# Altium schematic sheet Matrix.SchDoc
size B; SheetNumber: 2; SheetTotal: 2
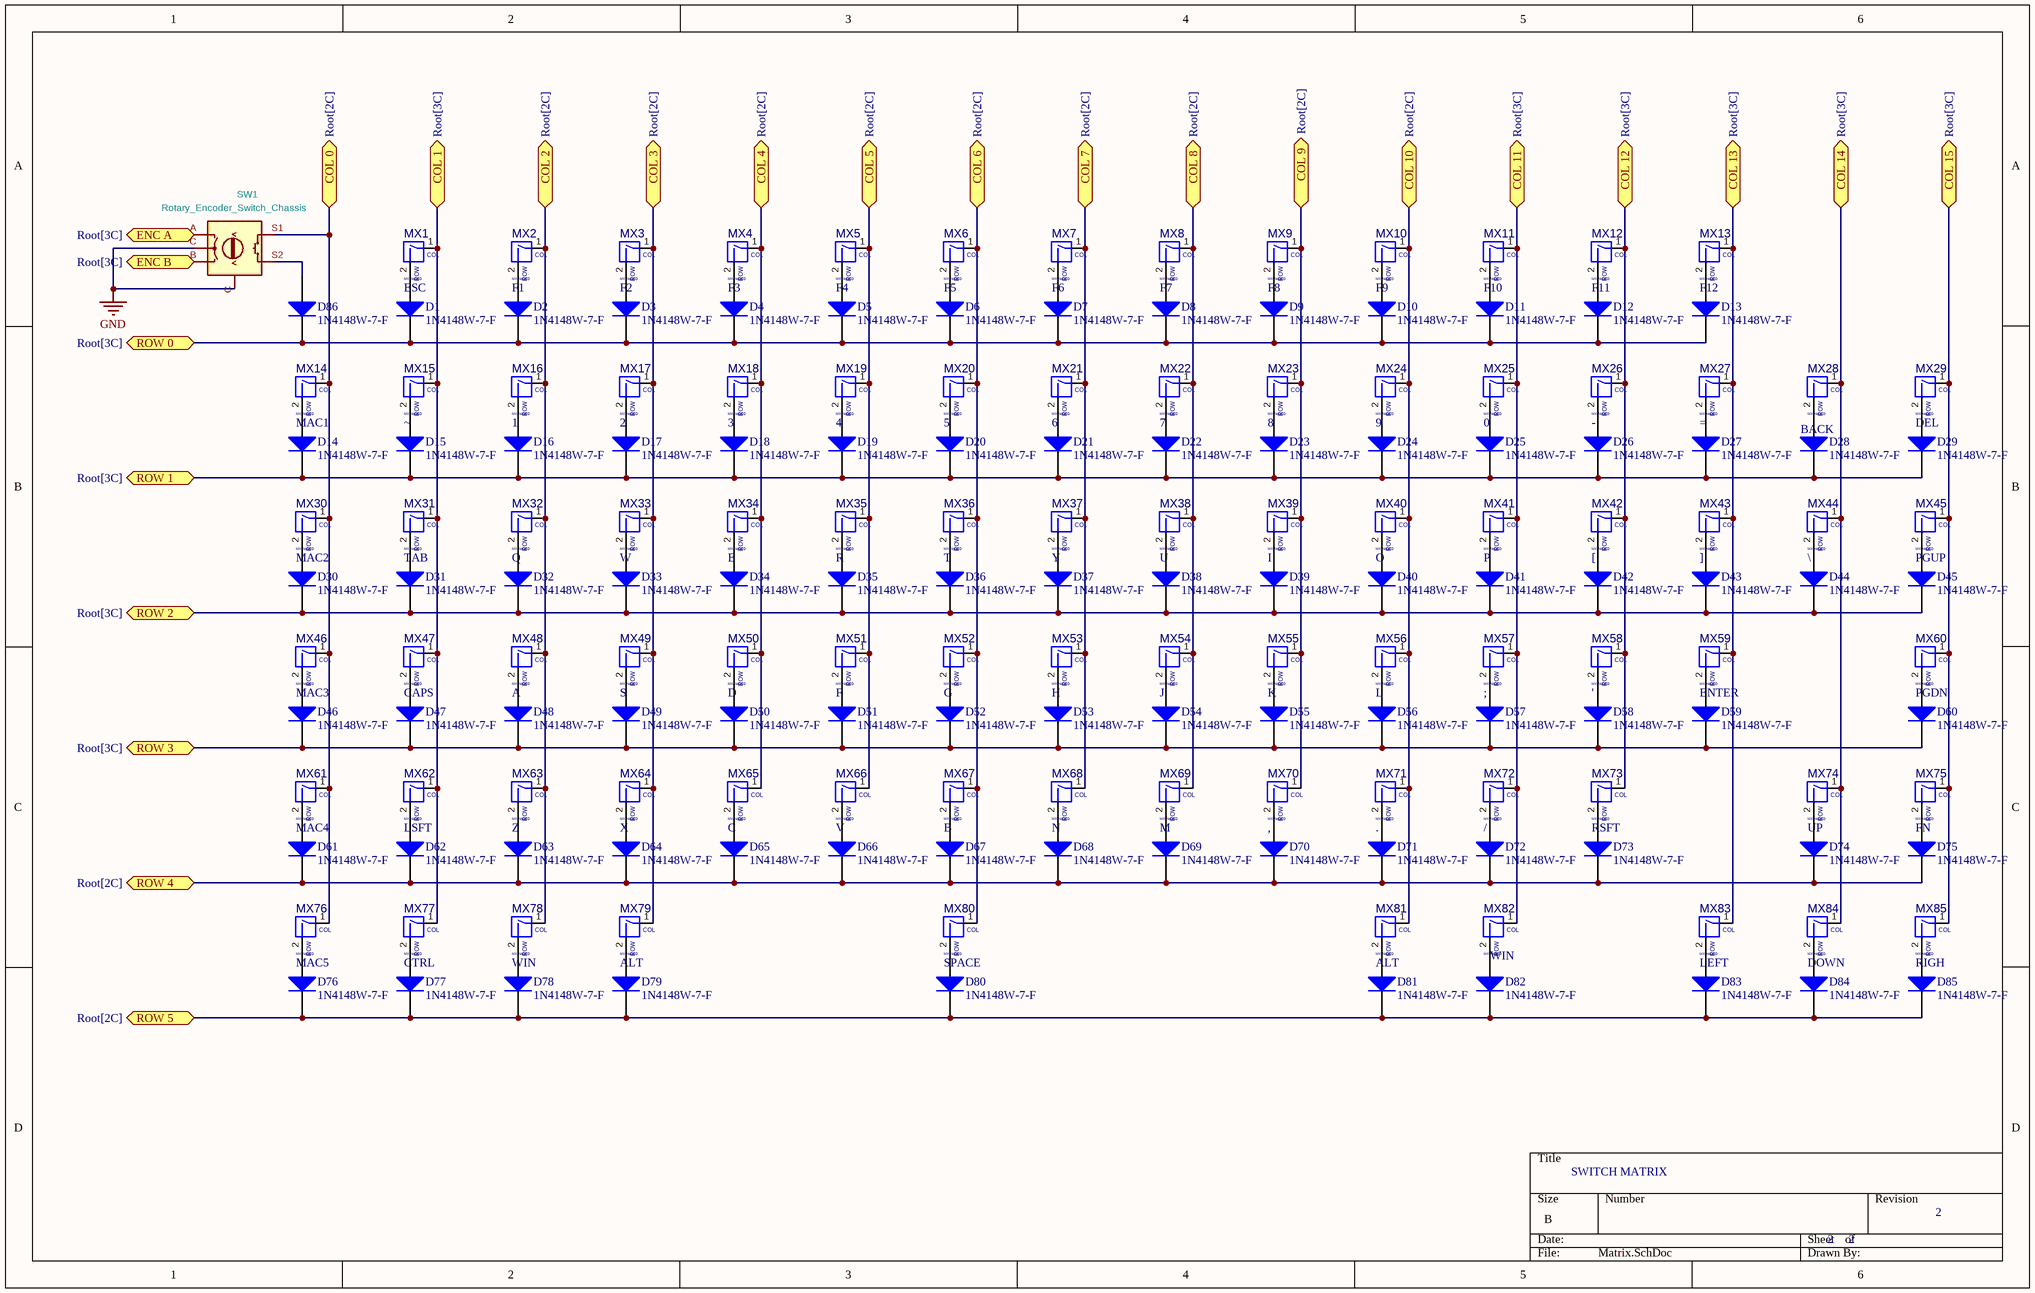
[diagram p0: Matrix.SchDoc]

## Parts
D1  1N4148W-7-F  [DIOD-SOD123-2_V]
D2  1N4148W-7-F  [DIOD-SOD123-2_V]
D3  1N4148W-7-F  [DIOD-SOD123-2_V]
D4  1N4148W-7-F  [DIOD-SOD123-2_V]
D5  1N4148W-7-F  [DIOD-SOD123-2_V]
D6  1N4148W-7-F  [DIOD-SOD123-2_V]
D7  1N4148W-7-F  [DIOD-SOD123-2_V]
D8  1N4148W-7-F  [DIOD-SOD123-2_V]
D9  1N4148W-7-F  [DIOD-SOD123-2_V]
D10  1N4148W-7-F  [DIOD-SOD123-2_V]
D11  1N4148W-7-F  [DIOD-SOD123-2_V]
D12  1N4148W-7-F  [DIOD-SOD123-2_V]
D13  1N4148W-7-F  [DIOD-SOD123-2_V]
D14  1N4148W-7-F  [DIOD-SOD123-2_V]
D15  1N4148W-7-F  [DIOD-SOD123-2_V]
D16  1N4148W-7-F  [DIOD-SOD123-2_V]
D17  1N4148W-7-F  [DIOD-SOD123-2_V]
D18  1N4148W-7-F  [DIOD-SOD123-2_V]
D19  1N4148W-7-F  [DIOD-SOD123-2_V]
D20  1N4148W-7-F  [DIOD-SOD123-2_V]
D21  1N4148W-7-F  [DIOD-SOD123-2_V]
D22  1N4148W-7-F  [DIOD-SOD123-2_V]
D23  1N4148W-7-F  [DIOD-SOD123-2_V]
D24  1N4148W-7-F  [DIOD-SOD123-2_V]
D25  1N4148W-7-F  [DIOD-SOD123-2_V]
D26  1N4148W-7-F  [DIOD-SOD123-2_V]
D27  1N4148W-7-F  [DIOD-SOD123-2_V]
D28  1N4148W-7-F  [DIOD-SOD123-2_V]
D29  1N4148W-7-F  [DIOD-SOD123-2_V]
D30  1N4148W-7-F  [DIOD-SOD123-2_V]
D31  1N4148W-7-F  [DIOD-SOD123-2_V]
D32  1N4148W-7-F  [DIOD-SOD123-2_V]
D33  1N4148W-7-F  [DIOD-SOD123-2_V]
D34  1N4148W-7-F  [DIOD-SOD123-2_V]
D35  1N4148W-7-F  [DIOD-SOD123-2_V]
D36  1N4148W-7-F  [DIOD-SOD123-2_V]
D37  1N4148W-7-F  [DIOD-SOD123-2_V]
D38  1N4148W-7-F  [DIOD-SOD123-2_V]
D39  1N4148W-7-F  [DIOD-SOD123-2_V]
D40  1N4148W-7-F  [DIOD-SOD123-2_V]
D41  1N4148W-7-F  [DIOD-SOD123-2_V]
D42  1N4148W-7-F  [DIOD-SOD123-2_V]
D43  1N4148W-7-F  [DIOD-SOD123-2_V]
D44  1N4148W-7-F  [DIOD-SOD123-2_V]
D45  1N4148W-7-F  [DIOD-SOD123-2_V]
D46  1N4148W-7-F  [DIOD-SOD123-2_V]
D47  1N4148W-7-F  [DIOD-SOD123-2_V]
D48  1N4148W-7-F  [DIOD-SOD123-2_V]
D49  1N4148W-7-F  [DIOD-SOD123-2_V]
D50  1N4148W-7-F  [DIOD-SOD123-2_V]
D51  1N4148W-7-F  [DIOD-SOD123-2_V]
D52  1N4148W-7-F  [DIOD-SOD123-2_V]
D53  1N4148W-7-F  [DIOD-SOD123-2_V]
D54  1N4148W-7-F  [DIOD-SOD123-2_V]
D55  1N4148W-7-F  [DIOD-SOD123-2_V]
D56  1N4148W-7-F  [DIOD-SOD123-2_V]
D57  1N4148W-7-F  [DIOD-SOD123-2_V]
D58  1N4148W-7-F  [DIOD-SOD123-2_V]
D59  1N4148W-7-F  [DIOD-SOD123-2_V]
D60  1N4148W-7-F  [DIOD-SOD123-2_V]
D61  1N4148W-7-F  [DIOD-SOD123-2_V]
D62  1N4148W-7-F  [DIOD-SOD123-2_V]
D63  1N4148W-7-F  [DIOD-SOD123-2_V]
D64  1N4148W-7-F  [DIOD-SOD123-2_V]
D65  1N4148W-7-F  [DIOD-SOD123-2_V]
D66  1N4148W-7-F  [DIOD-SOD123-2_V]
D67  1N4148W-7-F  [DIOD-SOD123-2_V]
D68  1N4148W-7-F  [DIOD-SOD123-2_V]
D69  1N4148W-7-F  [DIOD-SOD123-2_V]
D70  1N4148W-7-F  [DIOD-SOD123-2_V]
D71  1N4148W-7-F  [DIOD-SOD123-2_V]
D72  1N4148W-7-F  [DIOD-SOD123-2_V]
D73  1N4148W-7-F  [DIOD-SOD123-2_V]
D74  1N4148W-7-F  [DIOD-SOD123-2_V]
D75  1N4148W-7-F  [DIOD-SOD123-2_V]
D76  1N4148W-7-F  [DIOD-SOD123-2_V]
D77  1N4148W-7-F  [DIOD-SOD123-2_V]
D78  1N4148W-7-F  [DIOD-SOD123-2_V]
D79  1N4148W-7-F  [DIOD-SOD123-2_V]
D80  1N4148W-7-F  [DIOD-SOD123-2_V]
D81  1N4148W-7-F  [DIOD-SOD123-2_V]
D82  1N4148W-7-F  [DIOD-SOD123-2_V]
D83  1N4148W-7-F  [DIOD-SOD123-2_V]
D84  1N4148W-7-F  [DIOD-SOD123-2_V]
D85  1N4148W-7-F  [DIOD-SOD123-2_V]
D86  1N4148W-7-F  [DIOD-SOD123-2_V]
MX1  ESC  value MX-NoLED  [MXOnly-1U - duplicate]
MX2  F1  value MX-NoLED  [MXOnly-1U - duplicate]
MX3  F2  value MX-NoLED  [MXOnly-1U - duplicate]
MX4  F3  value MX-NoLED  [MXOnly-1U - duplicate]
MX5  F4  value MX-NoLED  [MXOnly-1U - duplicate]
MX6  F5  value MX-NoLED  [MXOnly-1U - duplicate]
MX7  F6  value MX-NoLED  [MXOnly-1U - duplicate]
MX8  F7  value MX-NoLED  [MXOnly-1U - duplicate]
MX9  F8  value MX-NoLED  [MXOnly-1U - duplicate]
MX10  F9  value MX-NoLED  [MXOnly-1U - duplicate]
MX11  F10  value MX-NoLED  [MXOnly-1U - duplicate]
MX12  F11  value MX-NoLED  [MXOnly-1U - duplicate]
MX13  F12  value MX-NoLED  [MXOnly-1U - duplicate]
MX14  MAC1  value MX-NoLED  [MXOnly-1U - duplicate]
MX15  ~  value MX-NoLED  [MXOnly-1U - duplicate]
MX16  1  value MX-NoLED  [MXOnly-1U - duplicate]
MX17  2  value MX-NoLED  [MXOnly-1U - duplicate]
MX18  3  value MX-NoLED  [MXOnly-1U - duplicate]
MX19  4  value MX-NoLED  [MXOnly-1U - duplicate]
MX20  5  value MX-NoLED  [MXOnly-1U - duplicate]
MX21  6  value MX-NoLED  [MXOnly-1U - duplicate]
MX22  7  value MX-NoLED  [MXOnly-1U - duplicate]
MX23  8  value MX-NoLED  [MXOnly-1U - duplicate]
MX24  9  value MX-NoLED  [MXOnly-1U - duplicate]
MX25  0  value MX-NoLED  [MXOnly-1U - duplicate]
MX26  -  value MX-NoLED  [MXOnly-1U - duplicate]
MX27  value MX-NoLED  [MXOnly-1U - duplicate]
MX28  BACK  value MX-NoLED  [MXOnly-2U - duplicate]
MX29  DEL  value MX-NoLED  [MXOnly-1U - duplicate]
MX30  MAC2  value MX-NoLED  [MXOnly-1U - duplicate]
MX31  TAB  value MX-NoLED  [MXOnly-1.5U - duplicate]
MX32  Q  value MX-NoLED  [MXOnly-1U - duplicate]
MX33  W  value MX-NoLED  [MXOnly-1U - duplicate]
MX34  E  value MX-NoLED  [MXOnly-1U - duplicate]
MX35  R  value MX-NoLED  [MXOnly-1U - duplicate]
MX36  T  value MX-NoLED  [MXOnly-1U - duplicate]
MX37  Y  value MX-NoLED  [MXOnly-1U - duplicate]
MX38  U  value MX-NoLED  [MXOnly-1U - duplicate]
MX39  I  value MX-NoLED  [MXOnly-1U - duplicate]
MX40  O  value MX-NoLED  [MXOnly-1U - duplicate]
MX41  P  value MX-NoLED  [MXOnly-1U - duplicate]
MX42  [  value MX-NoLED  [MXOnly-1U - duplicate]
MX43  ]  value MX-NoLED  [MXOnly-1U - duplicate]
MX44  \  value MX-NoLED  [MXOnly-1.5U - duplicate]
MX45  PGUP  value MX-NoLED  [MXOnly-1U - duplicate]
MX46  MAC3  value MX-NoLED  [MXOnly-1U - duplicate]
MX47  CAPS  value MX-NoLED  [MXOnly-1.75U - duplicate]
MX48  A  value MX-NoLED  [MXOnly-1U - duplicate]
MX49  S  value MX-NoLED  [MXOnly-1U - duplicate]
MX50  D  value MX-NoLED  [MXOnly-1U - duplicate]
MX51  F  value MX-NoLED  [MXOnly-1U - duplicate]
MX52  G  value MX-NoLED  [MXOnly-1U - duplicate]
MX53  H  value MX-NoLED  [MXOnly-1U - duplicate]
MX54  J  value MX-NoLED  [MXOnly-1U - duplicate]
MX55  K  value MX-NoLED  [MXOnly-1U - duplicate]
MX56  L  value MX-NoLED  [MXOnly-1U - duplicate]
MX57  ;  value MX-NoLED  [MXOnly-1U - duplicate]
MX58  '  value MX-NoLED  [MXOnly-1U - duplicate]
MX59  ENTER  value MX-NoLED  [MXOnly-2.25U - duplicate]
MX60  PGDN  value MX-NoLED  [MXOnly-1U - duplicate]
MX61  MAC4  value MX-NoLED  [MXOnly-1U - duplicate]
MX62  LSFT  value MX-NoLED  [MXOnly-2.25U - duplicate]
MX63  Z  value MX-NoLED  [MXOnly-1U - duplicate]
MX64  X  value MX-NoLED  [MXOnly-1U - duplicate]
MX65  C  value MX-NoLED  [MXOnly-1U - duplicate]
MX66  V  value MX-NoLED  [MXOnly-1U - duplicate]
MX67  B  value MX-NoLED  [MXOnly-1U - duplicate]
MX68  N  value MX-NoLED  [MXOnly-1U - duplicate]
MX69  M  value MX-NoLED  [MXOnly-1U - duplicate]
MX70  ,  value MX-NoLED  [MXOnly-1U - duplicate]
MX71  .  value MX-NoLED  [MXOnly-1U - duplicate]
MX72  /  value MX-NoLED  [MXOnly-1U - duplicate]
MX73  RSFT  value MX-NoLED  [MXOnly-1.75U - duplicate]
MX74  UP  value MX-NoLED  [MXOnly-1U - duplicate]
MX75  FN  value MX-NoLED  [MXOnly-1U - duplicate]
MX76  MAC5  value MX-NoLED  [MXOnly-1U - duplicate]
MX77  CTRL  value MX-NoLED  [MXOnly-1.25U - duplicate]
MX78  WIN  value MX-NoLED  [MXOnly-1.25U - duplicate]
MX79  ALT  value MX-NoLED  [MXOnly-1.25U - duplicate]
MX80  SPACE  value MX-NoLED  [MXOnly-6.25U-ReversedStabilizers - duplicate]
MX81  ALT  value MX-NoLED  [MXOnly-1.5U - duplicate]
MX82  WIN  value MX-NoLED  [MXOnly-1.5U - duplicate]
MX83  LEFT  value MX-NoLED  [MXOnly-1U - duplicate]
MX84  DOWN  value MX-NoLED  [MXOnly-1U - duplicate]
MX85  RIGH  value MX-NoLED  [MXOnly-1U - duplicate]
SW1  Rotary_Encoder_Switch_Chassis  [RotaryEncoder_Alps_EC11E-Switch_Vertical_H20mm]

## Ports
COL 0 (bidir, see Root[2C]), COL 1 (bidir, see Root[3C]), COL 2 (bidir, see Root[2C]), COL 3 (bidir, see Root[2C]), COL 4 (bidir, see Root[2C]), COL 5 (bidir, see Root[2C]), COL 6 (bidir, see Root[2C]), COL 7 (bidir, see Root[2C]), COL 8 (bidir, see Root[2C]), COL 9 (bidir, see Root[2C]), COL 10 (bidir, see Root[2C]), COL 11 (bidir, see Root[3C]), COL 12 (bidir, see Root[3C]), COL 13 (bidir, see Root[3C]), COL 14 (bidir, see Root[3C]), COL 15 (bidir, see Root[3C]), ENC A (bidir, see Root[3C]), ENC B (bidir, see Root[3C]), ROW 0 (bidir, see Root[3C]), ROW 1 (bidir, see Root[3C]), ROW 2 (bidir, see Root[3C]), ROW 3 (bidir, see Root[3C]), ROW 4 (bidir, see Root[2C]), ROW 5 (bidir, see Root[2C])

## Nets
GND: SW1.C(Shield)
COL 0: MX14.1(COL) MX30.1(COL) MX46.1(COL) MX61.1(COL) MX76.1(COL) SW1.S1 ; port COL 0
COL 1: MX1.1(COL) MX15.1(COL) MX31.1(COL) MX47.1(COL) MX62.1(COL) MX77.1(COL) ; port COL 1
COL 2: MX2.1(COL) MX16.1(COL) MX32.1(COL) MX48.1(COL) MX63.1(COL) MX78.1(COL) ; port COL 2
COL 3: MX3.1(COL) MX17.1(COL) MX33.1(COL) MX49.1(COL) MX64.1(COL) MX79.1(COL) ; port COL 3
COL 4: MX4.1(COL) MX18.1(COL) MX34.1(COL) MX50.1(COL) MX65.1(COL) ; port COL 4
COL 5: MX5.1(COL) MX19.1(COL) MX35.1(COL) MX51.1(COL) MX66.1(COL) ; port COL 5
COL 6: MX6.1(COL) MX20.1(COL) MX36.1(COL) MX52.1(COL) MX67.1(COL) MX80.1(COL) ; port COL 6
COL 7: MX7.1(COL) MX21.1(COL) MX37.1(COL) MX53.1(COL) MX68.1(COL) ; port COL 7
COL 8: MX8.1(COL) MX22.1(COL) MX38.1(COL) MX54.1(COL) MX69.1(COL) ; port COL 8
COL 9: MX9.1(COL) MX23.1(COL) MX39.1(COL) MX55.1(COL) MX70.1(COL) ; port COL 9
COL 10: MX10.1(COL) MX24.1(COL) MX40.1(COL) MX56.1(COL) MX71.1(COL) MX81.1(COL) ; port COL 10
COL 11: MX11.1(COL) MX25.1(COL) MX41.1(COL) MX57.1(COL) MX72.1(COL) MX82.1(COL) ; port COL 11
COL 12: MX12.1(COL) MX26.1(COL) MX42.1(COL) MX58.1(COL) MX73.1(COL) ; port COL 12
COL 13: MX13.1(COL) MX27.1(COL) MX43.1(COL) MX59.1(COL) MX83.1(COL) ; port COL 13
COL 14: MX28.1(COL) MX44.1(COL) MX74.1(COL) MX84.1(COL) ; port COL 14
COL 15: MX29.1(COL) MX45.1(COL) MX60.1(COL) MX75.1(COL) MX85.1(COL) ; port COL 15
ENC A: SW1.A ; port ENC A
ENC B: SW1.B ; port ENC B
ROW 0: D1.2(K) D2.2(K) D3.2(K) D4.2(K) D5.2(K) D6.2(K) D7.2(K) D8.2(K) D9.2(K) D10.2(K) D11.2(K) D12.2(K) D13.2(K) D86.2(K) ; port ROW 0
ROW 1: D14.2(K) D15.2(K) D16.2(K) D17.2(K) D18.2(K) D19.2(K) D20.2(K) D21.2(K) D22.2(K) D23.2(K) D24.2(K) D25.2(K) D26.2(K) D27.2(K) D28.2(K) D29.2(K) ; port ROW 1
ROW 2: D30.2(K) D31.2(K) D32.2(K) D33.2(K) D34.2(K) D35.2(K) D36.2(K) D37.2(K) D38.2(K) D39.2(K) D40.2(K) D41.2(K) D42.2(K) D43.2(K) D44.2(K) D45.2(K) ; port ROW 2
ROW 3: D46.2(K) D47.2(K) D48.2(K) D49.2(K) D50.2(K) D51.2(K) D52.2(K) D53.2(K) D54.2(K) D55.2(K) D56.2(K) D57.2(K) D58.2(K) D59.2(K) D60.2(K) ; port ROW 3
ROW 4: D61.2(K) D62.2(K) D63.2(K) D64.2(K) D65.2(K) D66.2(K) D67.2(K) D68.2(K) D69.2(K) D70.2(K) D71.2(K) D72.2(K) D73.2(K) D74.2(K) D75.2(K) ; port ROW 4
ROW 5: D76.2(K) D77.2(K) D78.2(K) D79.2(K) D80.2(K) D81.2(K) D82.2(K) D83.2(K) D84.2(K) D85.2(K) ; port ROW 5
NetD1_1: D1.1(A) MX1.2(ROW)
NetD2_1: D2.1(A) MX2.2(ROW)
NetD3_1: D3.1(A) MX3.2(ROW)
NetD4_1: D4.1(A) MX4.2(ROW)
NetD5_1: D5.1(A) MX5.2(ROW)
NetD6_1: D6.1(A) MX6.2(ROW)
NetD7_1: D7.1(A) MX7.2(ROW)
NetD8_1: D8.1(A) MX8.2(ROW)
NetD9_1: D9.1(A) MX9.2(ROW)
NetD10_1: D10.1(A) MX10.2(ROW)
NetD11_1: D11.1(A) MX11.2(ROW)
NetD12_1: D12.1(A) MX12.2(ROW)
NetD13_1: D13.1(A) MX13.2(ROW)
NetD14_1: D14.1(A) MX14.2(ROW)
NetD15_1: D15.1(A) MX15.2(ROW)
NetD16_1: D16.1(A) MX16.2(ROW)
NetD17_1: D17.1(A) MX17.2(ROW)
NetD18_1: D18.1(A) MX18.2(ROW)
NetD19_1: D19.1(A) MX19.2(ROW)
NetD20_1: D20.1(A) MX20.2(ROW)
NetD21_1: D21.1(A) MX21.2(ROW)
NetD22_1: D22.1(A) MX22.2(ROW)
NetD23_1: D23.1(A) MX23.2(ROW)
NetD24_1: D24.1(A) MX24.2(ROW)
NetD25_1: D25.1(A) MX25.2(ROW)
NetD26_1: D26.1(A) MX26.2(ROW)
NetD27_1: D27.1(A) MX27.2(ROW)
NetD28_1: D28.1(A) MX28.2(ROW)
NetD29_1: D29.1(A) MX29.2(ROW)
NetD30_1: D30.1(A) MX30.2(ROW)
NetD31_1: D31.1(A) MX31.2(ROW)
NetD32_1: D32.1(A) MX32.2(ROW)
NetD33_1: D33.1(A) MX33.2(ROW)
NetD34_1: D34.1(A) MX34.2(ROW)
NetD35_1: D35.1(A) MX35.2(ROW)
NetD36_1: D36.1(A) MX36.2(ROW)
NetD37_1: D37.1(A) MX37.2(ROW)
NetD38_1: D38.1(A) MX38.2(ROW)
NetD39_1: D39.1(A) MX39.2(ROW)
NetD40_1: D40.1(A) MX40.2(ROW)
NetD41_1: D41.1(A) MX41.2(ROW)
NetD42_1: D42.1(A) MX42.2(ROW)
NetD43_1: D43.1(A) MX43.2(ROW)
NetD44_1: D44.1(A) MX44.2(ROW)
NetD45_1: D45.1(A) MX45.2(ROW)
NetD46_1: D46.1(A) MX46.2(ROW)
NetD47_1: D47.1(A) MX47.2(ROW)
NetD48_1: D48.1(A) MX48.2(ROW)
NetD49_1: D49.1(A) MX49.2(ROW)
NetD50_1: D50.1(A) MX50.2(ROW)
NetD51_1: D51.1(A) MX51.2(ROW)
NetD52_1: D52.1(A) MX52.2(ROW)
NetD53_1: D53.1(A) MX53.2(ROW)
NetD54_1: D54.1(A) MX54.2(ROW)
NetD55_1: D55.1(A) MX55.2(ROW)
NetD56_1: D56.1(A) MX56.2(ROW)
NetD57_1: D57.1(A) MX57.2(ROW)
NetD58_1: D58.1(A) MX58.2(ROW)
NetD59_1: D59.1(A) MX59.2(ROW)
NetD60_1: D60.1(A) MX60.2(ROW)
NetD61_1: D61.1(A) MX61.2(ROW)
NetD62_1: D62.1(A) MX62.2(ROW)
NetD63_1: D63.1(A) MX63.2(ROW)
NetD64_1: D64.1(A) MX64.2(ROW)
NetD65_1: D65.1(A) MX65.2(ROW)
NetD66_1: D66.1(A) MX66.2(ROW)
NetD67_1: D67.1(A) MX67.2(ROW)
NetD68_1: D68.1(A) MX68.2(ROW)
NetD69_1: D69.1(A) MX69.2(ROW)
NetD70_1: D70.1(A) MX70.2(ROW)
NetD71_1: D71.1(A) MX71.2(ROW)
NetD72_1: D72.1(A) MX72.2(ROW)
NetD73_1: D73.1(A) MX73.2(ROW)
NetD74_1: D74.1(A) MX74.2(ROW)
NetD75_1: D75.1(A) MX75.2(ROW)
NetD76_1: D76.1(A) MX76.2(ROW)
NetD77_1: D77.1(A) MX77.2(ROW)
NetD78_1: D78.1(A) MX78.2(ROW)
NetD79_1: D79.1(A) MX79.2(ROW)
NetD80_1: D80.1(A) MX80.2(ROW)
NetD81_1: D81.1(A) MX81.2(ROW)
NetD82_1: D82.1(A) MX82.2(ROW)
NetD83_1: D83.1(A) MX83.2(ROW)
NetD84_1: D84.1(A) MX84.2(ROW)
NetD85_1: D85.1(A) MX85.2(ROW)
NetD86_1: D86.1(A) SW1.S2

## Notes on the sheet
- SWITCH MATRIX
- 2     2
- 2

## Library data of the parts
D1-D86 = CMP-004-00033-1: Rectifier Diode, 1 Phase, 1 Element, 0.15A, 100V V(RRM), Silicon; Forward Voltage: 715mV; Non-rep Pk Forward Current-Max: 1A; Number of Elements: 1; Time @ Peak Reflow Temperature-Max (s): 40s; Reverse Recovery Time-Max: 0.004us; Qualification Status: Not Qualified; Max Output current: 150mA; Max Power Dissipation: 400mW; Additional Feature: HIGH RELIABILITY; Package Body Material: Plastic; Min Operating Temperature: -65°C; Pins: 2; Max Operating Temperature: 150°C; RoHS Compliant: Yes; Diode Type: RECTIFIER; Peak Reflow Temperature (Cel): 260°C; Package Shape: Rectangular; Terminal Finish: Tin; Moisture Sensitivity Level: 1; Surface Mount: Yes; Reach SVHC Compliant: Yes; Diode Element Material: SILICON; JESD-30 Code: R-PDSO-G2; Terminal Form: Gull Wing; Rep Pk Reverse Voltage-Max: 100V; Terminal Position: DUAL; JESD-609 Code: e3; Package Style: SMALL OUTLINEMeter
MX1-MX85 = MX-NoLED
SW1 = Rotary_Encoder_Switch_Chassis: Value: Rotary_Encoder_Switch_Chassis; Footprint: acheronHardware:ALPS_EC11E